# EAGLE design li_ion_accum (EAGLE 5.08)
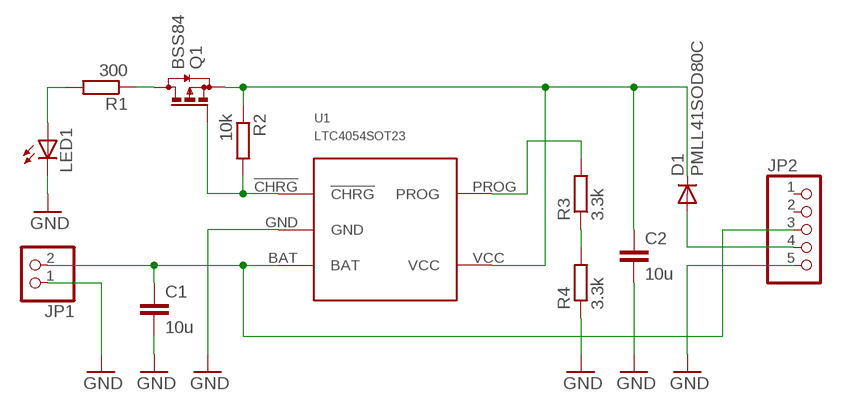
[diagram p0: schematic, sheet 1]

## Parts
C1  10u  C-EU025-050X050  [C025-050X050]
C2  10u  C-EU025-050X050  [C025-050X050]
D1  PMLL41SOD80C  [SOD80C]
JP1  PINHD-1X2  [1X02]
JP2  PINHD-1X5  [1X05]
LED1  LED5MM  [LED5MM]
Q1  BSS84  [SOT23]
R1  300  R-EU_R1206  [R1206]
R2  10k  R-EU_R1206  [R1206]
R3  3.3k  R-EU_R1206  [R1206]
R4  3.3k  R-EU_R1206  [R1206]
U1  LTC4054SOT23  [SOT23-5]

## Nets
GND: C1.2 C2.2 JP1.1 JP2.5 LED1.K(C) R4.1 U1.GND
N$1: LED1.A R1.2
N$2: R3.2 U1.PROG
N$3: Q1.3(D) R1.1
N$4: R3.1 R4.2
N$5: C1.1 JP1.2 JP2.3 U1.BAT
N$6: Q1.1(G) R2.2 U1.!CHRG
N$7: D1.A JP2.4
N$8: C2.1 D1.C Q1.2(S) R2.1 U1.VCC
Unconnected: JP2.1 JP2.2

## Library data of the parts
C1 C2 = rcl:C-EU: CAPACITOR, European symbol
D1 = diode:PMLL41*: High-speed diodes Source: http://www.semiconductors.philips.com/acrobat_download/datasheets/PMLL4150_2.pdf
JP1 = pinhead:PINHD-1X2: PIN HEADER
JP2 = pinhead:PINHD-1X5: PIN HEADER
LED1 = led:LED: LED OSRAM: - CHIPLED LG R971, LG N971, LY N971, LG Q971, LY Q971, LO R971, LY R971 LH N974, LH R974 LS Q976, LO Q976, LY Q976 LO Q996 - Hyper CHIPLED LW Q18S LB Q993, LB Q99A, LB R99A - SideLED LS A670, LO A670, LY A670, LG A670, LP A670 LB A673, LV A673, LT A673, LW A673 LH A674 LY A675 LS A676, LA A676, LO A676, LY A676, LW A676 LS A679, LY A679, LG A679 - Hyper Micro SIDELED® LS Y876, LA Y876, LO Y876, LY Y876 LT Y87S - SmartLED LW L88C, LW L88S LB L89C, LB L89S, LG L890 LS L89K, LO L89K, LY L89K LS L896, LA L896, LO L896, LY L896 - TOPLED LS T670, LO T670, LY T670, LG T670, LP T670 LSG T670, LSP T670, LSY T670, LOP T670, LYG T670 LG T671, LOG T671, LSG T671 LB T673, LV T673, LT T673, LW T673 LH T674 LS T676, LA T676, LO T676, LY T676, LB T676, LH T676, LSB T676, LW T676 LB T67C, LV T67C, LT T67C, LS T67K, LO T67K, LY T67K, LW E67C LS E67B, LA E67B, LO E67B, LY E67B, LB E67C, LV E67C, LT E67C LW T67C LS T679, LY T679, LG T679 LS T770, LO T770, LY T770, LG T770, LP T770 LB T773, LV T773, LT T773, LW T773 LH T774 LS E675, LA E675, LY E675, LS T675 LS T776, LA T776, LO T776, LY T776, LB T776 LHGB T686 LT T68C, LB T68C - Hyper Mini TOPLED® LB M676 - Mini TOPLED Santana® LG M470 LS M47K, LO M47K, LY M47K Source: http://www.osram.convergy.de LUXEON: - LUMILED® LXK2-PW12-R00, LXK2-PW12-S00, LXK2-PW14-U00, LXK2-PW14-V00 LXK2-PM12-R00, LXK2-PM12-S00, LXK2-PM14-U00 LXK2-PE12-Q00, LXK2-PE12-R00, LXK2-PE12-S00, LXK2-PE14-T00, LXK2-PE14-U00 LXK2-PB12-K00, LXK2-PB12-L00, LXK2-PB12-M00, LXK2-PB14-N00, LXK2-PB14-P00, LXK2-PB14-Q00 LXK2-PR12-L00, LXK2-PR12-M00, LXK2-PR14-Q00, LXK2-PR14-R00 LXK2-PD12-Q00, LXK2-PD12-R00, LXK2-PD12-S00 LXK2-PH12-R00, LXK2-PH12-S00 LXK2-PL12-P00, LXK2-PL12-Q00, LXK2-PL12-R00 Source: www.luxeon.com KINGBRIGHT: KA-3528ASYC Source: www.kingbright.com
Q1 = transistor-small-signal:BSS84: P-CHANNEL MOS FET
R1-R4 = rcl:R-EU_: RESISTOR, European symbol
U1 = stabil:LTC4054

## Board
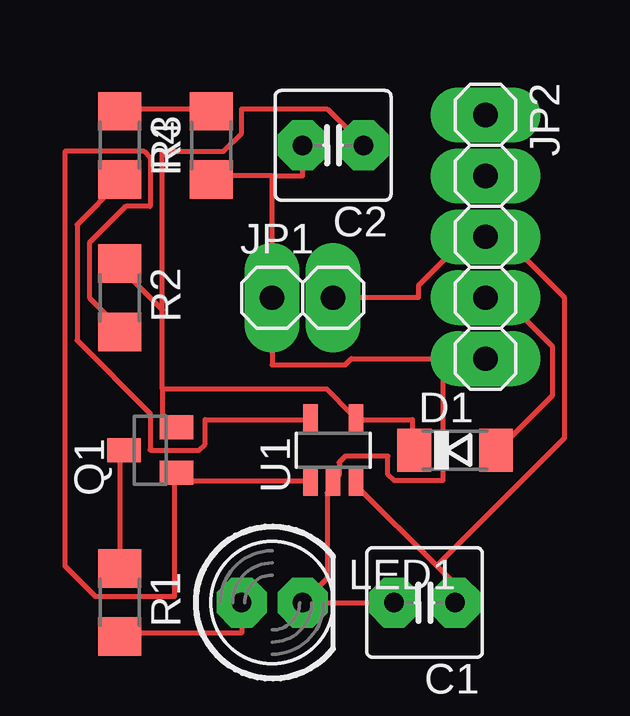
[diagram p1: board, top side]

No outline drawn. Coordinates in mm, seen from the top.
Copper layers (1*16): Top 0.035mm / dielectric 1.5mm / Bottom 0.035mm
Design rules "default": minimum track width 8mil, minimum drill 32mil, track to track 8mil, track to pad 8mil, pad to pad 8mil, via to via 8mil, smd to smd 8mil, copper to edge 40mil, drill to drill 40mil, minimum pad ring 25mil, minimum via ring 12mil, stop-mask expansion 4mil, vias tented up to drill 0mil, thermal gap 10mil

### Footprints (pad centres in the part's own frame; a part is rotated, then mirrored left to right if it is on the bottom)
C025-050X050 = drill 0.813 octagon: 1 -1.27,0; 2 1.27,0
SOD80C = smd 1.4 x 1.8: A 1.7,0; C -1.7,0
1X02 = drill 1.016 long: 1 -1.27,0; 2 1.27,0
1X05 = drill 1.016 long: 1 -5.08,0; 2 -2.54,0; 3 0,0; 4 2.54,0; 5 5.08,0
LED5MM = drill 0.813 octagon: A -1.27,0; K 1.27,0
SOT23 = smd 1 x 1.4: 1 -0.95,-1.1; 2 0.95,-1.1; 3 0,1.1
R1206 = smd 1.6 x 1.803: 1 -1.422,0; 2 1.422,0
SOT23-5 = smd 0.6 x 1.2: !CHRG -0.95,-1.306; BAT 0.95,-1.306; GND 0,-1.306; PROG -0.95,1.306; VCC 0.95,1.306

### Placement (x,y rotation side)
C1  -8.89,3.81 180 top
C2  -12.7,22.86 180 top
D1  -7.62,10.16 0 top
JP1  -13.97,16.51 0 top
JP2  -6.35,19.05 270 top
LED1  -15.24,3.81 0 top
Q1  -20.32,10.16 90 top
R1  -21.59,3.81 270 top
R2  -21.59,16.51 270 top
R3  -21.59,22.86 270 top
R4  -17.78,22.86 90 top
U1  -12.7,10.16 0 top

### Tracks (layer width: path | path; a pad name or v marks a point on that pad's centre or on a via)
GND
  Top 0.203: C1.2 LED1.K -12.95,4.83 -12.95,8.38 -12.7,8.64 U1.GND -12.7,8.89 -12.45,9.14 -12.45,9.65 -12.19,9.91 -10.41,9.91 -10.41,9.14 -10.16,8.89 -8.13,8.89 -8.13,13.97 | -15.24,21.59 -13.97,21.59 C2.2 | -15.24,21.59 -17.78,21.59 R4.1 | -15.24,21.59 JP1.1 -15.24,13.72 -12.19,13.72 -11.94,13.97 -8.13,13.97 | -8.13,13.97 JP2.5
N$1
  Top 0.203: LED1.A -16.51,2.54 -21.59,2.54 R1.2
N$2
  Top 0.203: U1.PROG -13.72,11.43 -18.03,11.43 -18.03,10.41 -18.29,10.16 -20.32,10.16 -20.32,11.68 -23.37,14.73 -23.37,19.56 -21.59,21.34 R3.2
N$3
  Top 0.203: Q1.3 -21.59,10.16 R1.1
N$4
  Top 0.203: R3.1 -21.59,24.38 -17.78,24.38 R4.2
N$5
  Top 0.203: -8.38,5.33 -7.62,4.57 C1.1 | -8.38,5.33 -11.68,8.64 U1.BAT | JP1.2 -9.14,16.51 -9.14,17.02 -7.11,19.05 JP2.3 -5.59,19.05 -3.05,16.51 -3.05,10.67 -8.38,5.33
N$6
  Top 0.203: U1.!CHRG -13.72,8.89 -19.05,8.89 -19.05,9.14 Q1.1 -19.3,9.14 -19.3,4.06 -22.61,4.06 -23.88,5.33 -23.88,22.61 -20.57,22.61 -20.32,22.35 -20.32,20.32 -21.34,20.32 -22.86,18.8 -22.86,16.51 -21.59,15.24 R2.2
N$7
  Top 0.203: JP2.4 -5.59,16.51 -3.56,14.48 -3.56,12.45 -5.84,10.16 D1.A
N$8
  Top 0.203: D1.C -9.4,10.16 -9.4,11.43 -11.68,11.43 U1.VCC -11.94,11.68 -12.95,12.7 -19.81,12.7 | -19.81,12.7 -19.81,16 | -19.81,12.7 -19.81,11.68 -19.3,11.18 Q1.2 | -19.81,16 -21.59,17.78 R2.1 | C2.1 -12.95,24.38 -16.51,24.38 -16.51,23.37 -17.27,22.61 -19.81,22.61 -19.81,16